# EAGLE schematic PWM_READER (EAGLE 9.1.1)
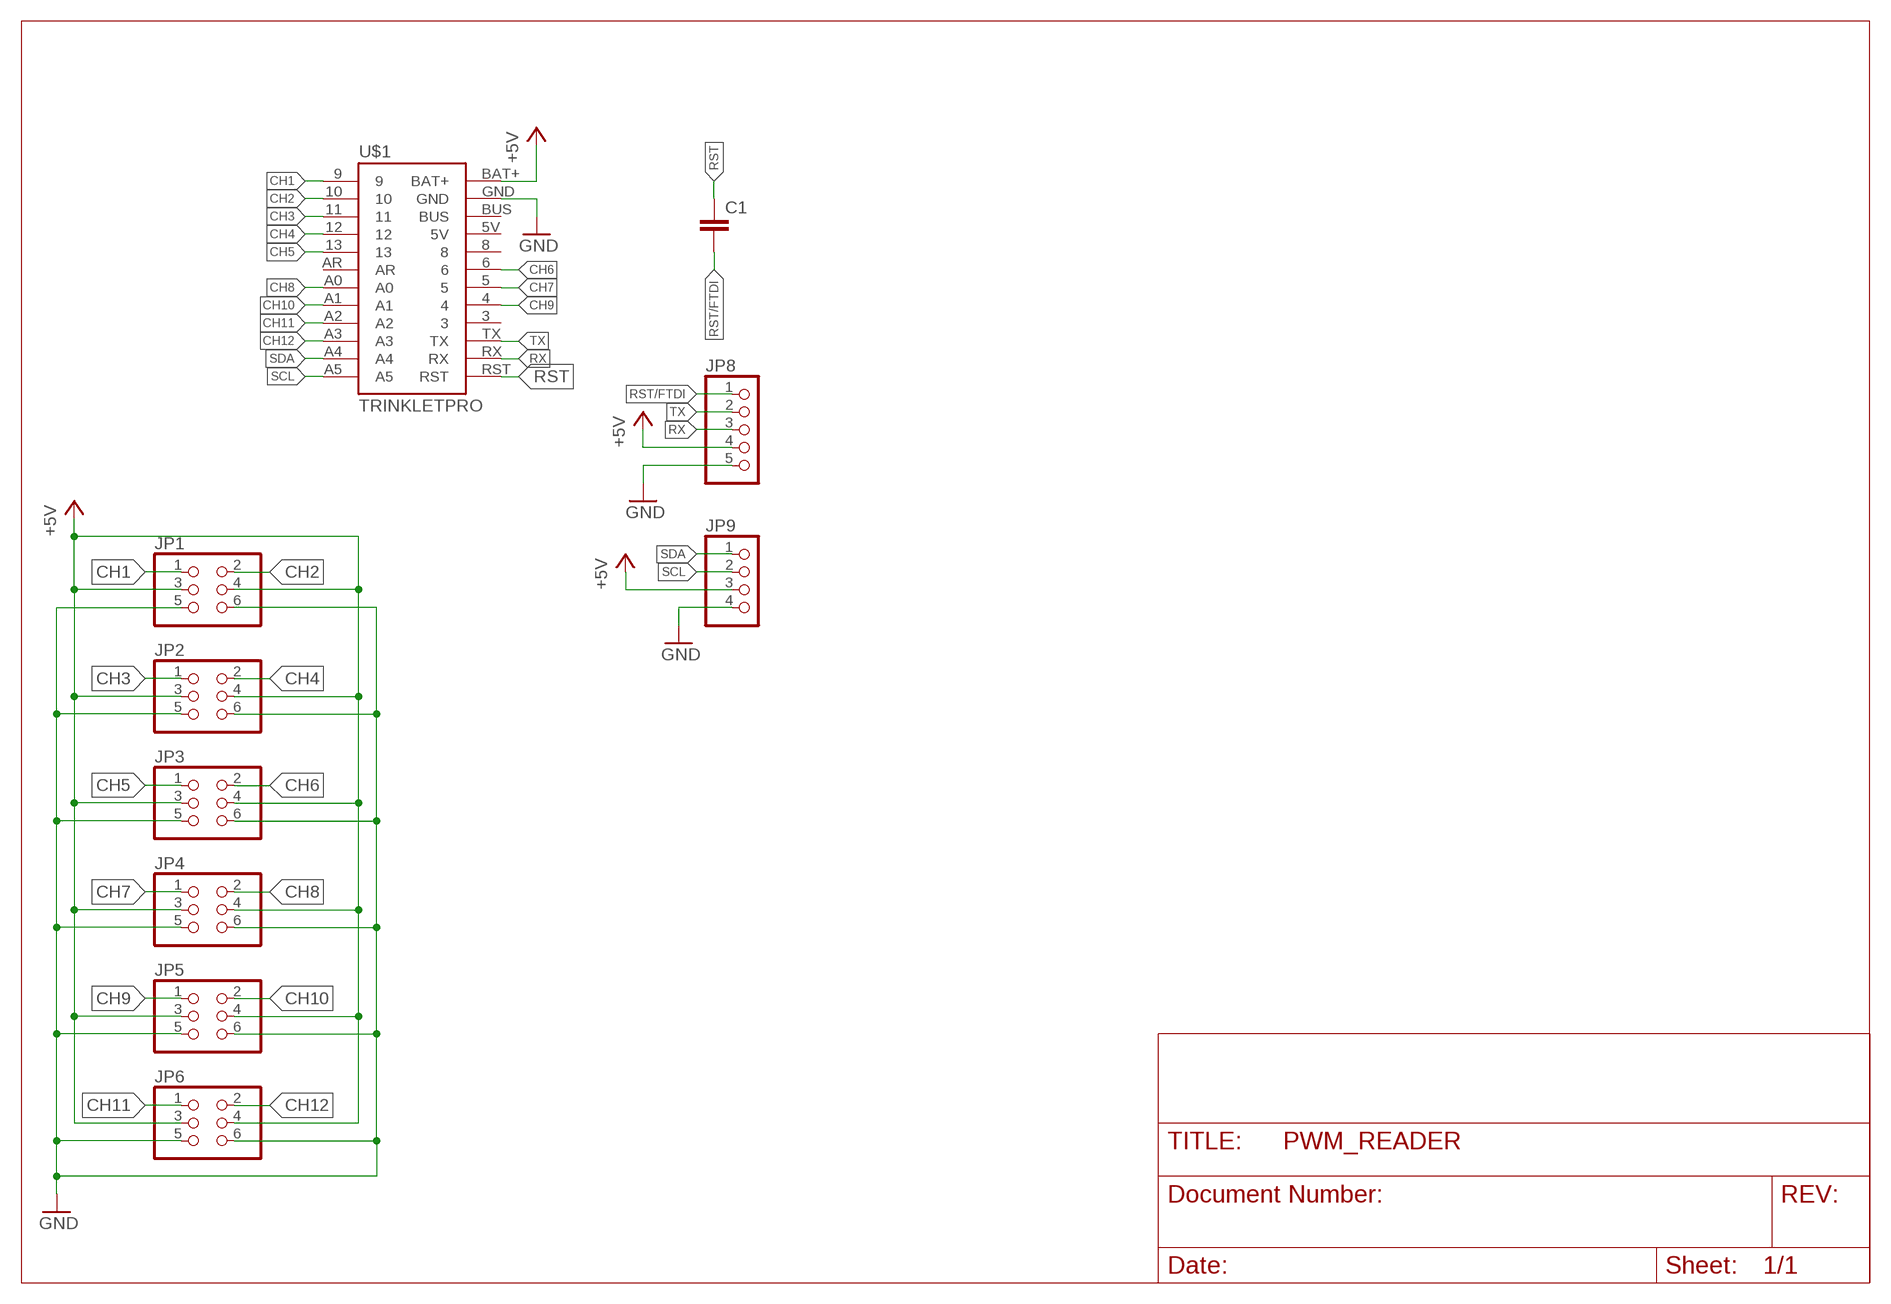
[diagram p0: schematic, sheet 1]

## Parts
C1  C-EUC0805  [C0805]
JP1  PINHD-2X3  [2X03]
JP2  PINHD-2X3  [2X03]
JP3  PINHD-2X3  [2X03]
JP4  PINHD-2X3  [2X03]
JP5  PINHD-2X3  [2X03]
JP6  PINHD-2X3  [2X03]
JP8  PINHD-1X5  [1X05]
JP9  PINHD-1X4  [1X04]
U$1  TRINKLETPRO  [1X12]

## Nets
+5V: JP1.3 JP1.4 JP2.3 JP2.4 JP3.3 JP3.4 JP4.3 JP4.4 JP5.3 JP5.4 JP6.3 JP6.4 JP8.4 JP9.3 U$1.BAT+
CH1: JP1.1 U$1.9
CH2: JP1.2 U$1.10
CH3: JP2.1 U$1.11
CH4: JP2.2 U$1.12
CH5: JP3.1 U$1.13
CH6: JP3.2 U$1.6
CH7: JP4.1 U$1.5
CH8: JP4.2 U$1.A0
CH9: JP5.1 U$1.4
CH10: JP5.2 U$1.A1
CH11: JP6.1 U$1.A2
CH12: JP6.2 U$1.A3
GND: JP1.5 JP1.6 JP2.5 JP2.6 JP3.5 JP3.6 JP4.5 JP4.6 JP5.5 JP5.6 JP6.5 JP6.6 JP8.5 JP9.4 U$1.GND
RST: C1.1 U$1.RST
RST/FTDI: C1.2 JP8.1
RX: JP8.3 U$1.RX
SCL: JP9.2 U$1.A5
SDA: JP9.1 U$1.A4
TX: JP8.2 U$1.TX
Unconnected: U$1.3 U$1.5V U$1.8 U$1.AR U$1.BUS

## Library data of the parts
C1 = rcl:C-EU: CAPACITOR, European symbol; SPICEPREFIX: C
JP1-JP6 = pinhead:PINHD-2X3: PIN HEADER
JP8 = pinhead:PINHD-1X5: PIN HEADER
JP9 = pinhead:PINHD-1X4: PIN HEADER
U$1 = KLAUS:TRINKLETPRO